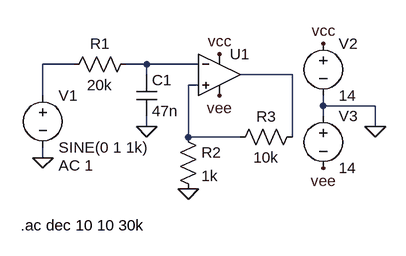
[diagram p0: schematic exp-3lpf.asc]
exp-3lpf.asc, the LTspice schematic file:
Version 4
SHEET 1 880 680
WIRE 128 112 80 112
WIRE 240 112 208 112
WIRE 320 112 240 112
WIRE 240 128 240 112
WIRE 464 128 384 128
WIRE 320 144 304 144
WIRE 80 160 80 112
WIRE 512 176 512 160
WIRE 592 176 512 176
WIRE 512 192 512 176
WIRE 240 208 240 192
WIRE 592 208 592 176
WIRE 304 224 304 144
WIRE 384 224 304 224
WIRE 464 224 464 128
WIRE 80 256 80 240
FLAG 80 256 0
FLAG 240 208 0
FLAG 304 304 0
FLAG 592 208 0
FLAG 352 96 vcc
FLAG 512 80 vcc
FLAG 352 160 vee
FLAG 512 272 vee
SYMBOL voltage 80 144 R0
WINDOW 123 24 124 Left 2
WINDOW 39 0 0 Left 0
SYMATTR InstName V1
SYMATTR Value SINE(0 1 1k)
SYMATTR Value2 AC 1
SYMBOL res 224 96 R90
WINDOW 0 0 56 VBottom 2
WINDOW 3 32 56 VTop 2
SYMATTR InstName R1
SYMATTR Value 20k
SYMBOL cap 224 128 R0
SYMATTR InstName C1
SYMATTR Value 47n
SYMBOL Opamps\\UniversalOpamp2 352 128 R0
SYMATTR InstName U1
SYMBOL res 288 208 R0
SYMATTR InstName R2
SYMATTR Value 1k
SYMBOL res 480 208 R90
WINDOW 0 0 56 VBottom 2
WINDOW 3 32 56 VTop 2
SYMATTR InstName R3
SYMATTR Value 10k
SYMBOL voltage 512 64 R0
WINDOW 123 0 0 Left 0
WINDOW 39 0 0 Left 0
SYMATTR InstName V2
SYMATTR Value 14
SYMBOL voltage 512 176 R0
WINDOW 123 0 0 Left 0
WINDOW 39 0 0 Left 0
SYMATTR InstName V3
SYMATTR Value 14
TEXT 46 360 Left 2 !.ac dec 10 10 30k

The netlist it stands for:
* exp-3lpf.asc
V1 N001 0 SINE(0 1 1k) AC 1
R1 N002 N001 20k
C1 N002 0 47n
XU1 N004 N002 vcc vee N003 level.2 Avol=1Meg GBW=10Meg Slew=10Meg ilimit=25m rail=0 Vos=0 phimargin=45 en=0 enk=0 in=0 ink=0 Rin=500Meg  ; pins IN+ IN- V+ V- OUT
R2 N004 0 1k
R3 N003 N004 10k
V2 vcc 0 14
V3 0 vee 14
.ac dec 10 10 30k
.lib UniversalOpamps2.sub
.backanno
.end